# Altium project UWB-Anchor.PrjPCB
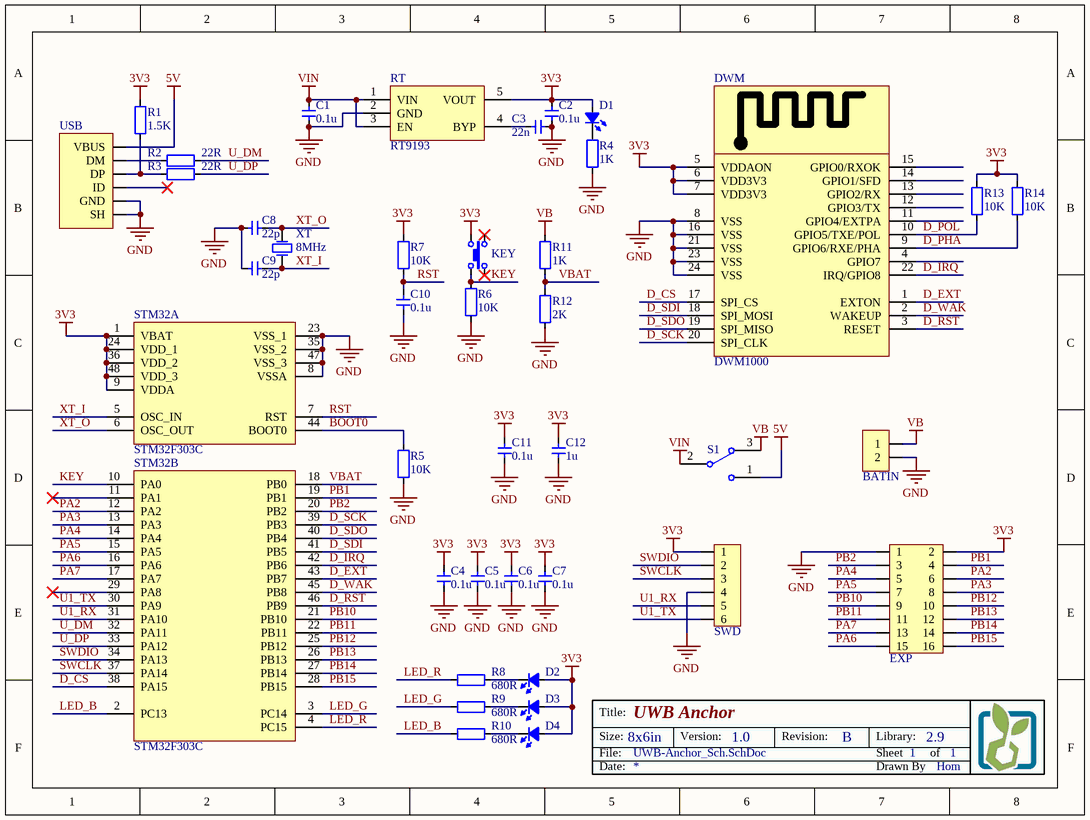
[diagram p0: UWB-Anchor_Sch.SchDoc]
1 sheet, 40 parts. Net scope: global (net labels, ports and power ports of the same name join across sheets).
Board file: UWB-Anchor_Pcb.PcbDoc

## Sheet UWB-Anchor_Sch.SchDoc: UWB Anchor
size 203 x 152 mm; Author: Hom; CompanyName: KitSprout; DrawnBy: Hom; Engineer: Hom; Organization: KitSprout; Revision: B; SheetNumber: 1; SheetTotal: 1; Version: 1.0; LibVersion: 2.9; PageSetup: Record=PageOptions|CenterHorizontal=True|CenterVertical=True|PrintScale=1.00|XCorrection=1.00|YCorrection=1.00|PrintKind=0|BorderSize=5000000|LeftOffset=0|BottomOffset=0|Orientation=2|PaperLength=1000|PaperWidth=1000|Scale=100|PaperSource=7|PrintQuality=-3|MediaType=1|DitherType=10|PrintScaleMode=0|PaperKind=A4|PaperIndex=9

### Parts
BATIN  MX1.25_2P  [MX1.25_S90_2P]  (value not drawn)
C1  value 0.1u  [CAP_0603]  (hidden comment: Cap_0603)
C2  value 0.1u  [CAP_0603]  (hidden comment: Cap_0603)
C3  value 22n  [CAP_0603]  (hidden comment: Cap_0603)
C4  value 0.1u  [CAP_0603]  (hidden comment: Cap_0603)
C5  value 0.1u  [CAP_0603]  (hidden comment: Cap_0603)
C6  value 0.1u  [CAP_0603]  (hidden comment: Cap_0603)
C7  value 0.1u  [CAP_0603]  (hidden comment: Cap_0603)
C8  value 22p  [CAP_0603]  (hidden comment: Cap_0603)
C9  value 22p  [CAP_0603]  (hidden comment: Cap_0603)
C10  value 0.1u  [CAP_0603]  (hidden comment: Cap_0603)
C11  value 0.1u  [CAP_0603]  (hidden comment: Cap_0603)
C12  value 1u  [CAP_0603]  (hidden comment: Cap_0603)
D1  LED_0603  [LED_0603_YELLOW]  (value not drawn)
D2  LED_0603  [LED_0603_RED]  (value not drawn)
D3  LED_0603  [LED_0603_GREEN]  (value not drawn)
D4  LED_0603  [LED_0603_BLUE]  (value not drawn)
DWM  DWM1000  [DWM1000]
EXP  HDR2x8_2.54  [HDR2X8_2.54_180]  (value not drawn)
KEY  ButtonTACT  [ButtonTACT_3.5*3.55_90]  (value not drawn)
R1  value 1.5K  [RES_0603]  (hidden comment: Res_0603)
R2  value 22R  [RES_0603]  (hidden comment: Res_0603)
R3  value 22R  [RES_0603]  (hidden comment: Res_0603)
R4  value 1K  [RES_0603]  (hidden comment: Res_0603)
R5  value 10K  [RES_0603]  (hidden comment: Res_0603)
R6  value 10K  [RES_0603]  (hidden comment: Res_0603)
R7  value 10K  [RES_0603]  (hidden comment: Res_0603)
R8  value 680R  [RES_0603]  (hidden comment: Res_0603)
R9  value 680R  [RES_0603]  (hidden comment: Res_0603)
R10  value 680R  [RES_0603]  (hidden comment: Res_0603)
R11  value 1K  [RES_0603]  (hidden comment: Res_0603)
R12  value 2K  [RES_0603]  (hidden comment: Res_0603)
R13  value 10K  [RES_0603]  (hidden comment: Res_0603)
R14  value 10K  [RES_0603]  (hidden comment: Res_0603)
RT  RT9193  [SOT23-5]
S1  SwitchSPDT_2.8x6.6_90  [SwitchSPDT_2.8X6.6_90]  (value not drawn)
STM32  STM32F303C  [LQFP_P0.5_48]  (parts A,B of 2)
SWD  HDR1x6_1.27  [HDR1X6_1.27_180HFD]  (value not drawn)
USB  USB_Micro  [USB_Micro-AB]  (value not drawn)
XT  value 8MHz  [XT_5032_2]  (hidden comment: XTAL_5032_2P)

### Nets
3V3: C2.2 C4.2 C5.2 C6.2 C7.2 C11.1 C12.1 D1.1(A) D2.1(A) D3.1(A) D4.1(A) DWM.5(VDDAON) DWM.6(VDD3V3) DWM.7(VDD3V3) EXP.2 KEY.2 R1.1 R7.2 R13.2 R14.2 RT.5(VOUT) STM32.1(VBAT) STM32.9(VDDA) STM32.24(VDD_1) STM32.36(VDD_2) STM32.48(VDD_3) SWD.1
5V: S1.1 USB.1(VBUS)
GND: BATIN.2 C1.1 C2.1 C3.1 C4.1 C5.1 C6.1 C7.1 C8.2 C9.2 C10.1 C11.2 C12.2 DWM.8(VSS) DWM.16(VSS) DWM.21(VSS) DWM.23(VSS) DWM.24(VSS) EXP.1 R4.1 R5.1 R6.1 R12.2 RT.2(GND) STM32.8(VSSA) STM32.23(VSS_1) STM32.35(VSS_2) STM32.47(VSS_3) SWD.4 USB.0(SH) USB.5(GND)
VB: BATIN.1 R11.1 S1.3
VIN: C1.2 RT.1(VIN) RT.3(EN) S1.2
BOOT0: R5.2 STM32.44(BOOT0)
D_CS: DWM.17(SPI_CS) STM32.38(PA15)
D_EXT: DWM.1(EXTON) STM32.43(PB7)
D_IRQ: DWM.22(IRQ/GPIO8) STM32.42(PB6)
D_PHA: DWM.9(GPIO6/RXE/PHA) R14.1
D_POL: DWM.10(GPIO5/TXE/POL) R13.1
D_RST: DWM.3(RESET) STM32.46(PB9)
D_SCK: DWM.20(SPI_CLK) STM32.39(PB3)
D_SDI: DWM.18(SPI_MOSI) STM32.41(PB5)
D_SDO: DWM.19(SPI_MISO) STM32.40(PB4)
D_WAK: DWM.2(WAKEUP) STM32.45(PB8)
KEY: KEY.1 R6.2 STM32.10(PA0)
LED_B: R10.2 STM32.2(PC13)
LED_G: R9.2 STM32.3(PC14)
LED_R: R8.2 STM32.4(PC15)
PA2: EXP.6 STM32.12(PA2)
PA3: EXP.8 STM32.13(PA3)
PA4: EXP.5 STM32.14(PA4)
PA5: EXP.7 STM32.15(PA5)
PA6: EXP.15 STM32.16(PA6)
PA7: EXP.13 STM32.17(PA7)
PB1: EXP.4 STM32.19(PB1)
PB2: EXP.3 STM32.20(PB2)
PB10: EXP.9 STM32.21(PB10)
PB11: EXP.11 STM32.22(PB11)
PB12: EXP.10 STM32.25(PB12)
PB13: EXP.12 STM32.26(PB13)
PB14: EXP.14 STM32.27(PB14)
PB15: EXP.16 STM32.28(PB15)
RST: C10.2 R7.1 STM32.7(RST)
SWCLK: STM32.37(PA14) SWD.3
SWDIO: STM32.34(PA13) SWD.2
U1_RX: STM32.31(PA10) SWD.5
U1_TX: STM32.30(PA9) SWD.6
U_DM: R2.2 STM32.32(PA11)
U_DP: R3.2 STM32.33(PA12)
VBAT: R11.2 R12.1 STM32.18(PB0)
XT_I: C9.1 STM32.5(OSC_IN) XT.1(OSC1)
XT_O: C8.1 STM32.6(OSC_OUT) XT.2(OSC2)
NetC3_2: C3.2 RT.4(BYP)
NetD1_2: D1.2(K) R4.2
NetD2_2: D2.2(K) R8.1
NetD3_2: D3.2(K) R9.1
NetD4_2: D4.2(K) R10.1
NetR1_2: R1.2 R3.1 USB.3(DP)
NetR2_1: R2.1 USB.2(DM)

Not connected (* = marked no-connect by the designer): DWM 4(GPIO7) 11(GPIO4/EXTPA) 12(GPIO3/TX) 13(GPIO2/RX) 14(GPIO1/SFD) 15(GPIO0/RXOK); KEY 3* 4*; STM32 11(PA1)* 29(PA8)*; USB 4(ID)*

### Notes on the sheet
- Title:
- Size:
- Date:
- File:
- 8x6in
- Version:
- Revision:
- Sheet
- Drawn By
- Library:
- of

### Library data of the parts
BATIN = MX1.25_2P: MX
C1-C12 = Cap_0603: Capacitor
D1-D4 = LED_0603: LED
DWM = DWM1000: Module; Manufacturer: Decawave Limited; Frequency: 3.5GHz ~ 6.5GHz; Data Rate: 6.8Mbps; Serial Interfaces: SPI; Antenna Type: Integrated, Chip; Voltage - Supply: 2.8 V ~ 3.6 V; Current - Receiving: 64mA; Current - Transmitting: 31mA; Supplier 1: Digi-Key; Manufacturer Part Number: DWM1000; RoHS: RoHS Compliant; Category: RF/IF and RFID; Stock 1: 1028; Pricing 1: 1=32.16, 10=26.704, 100=24.24, 250=22.51296 (USD); Packaging: Cut Tape (CT); RF Family/Standard: 802.15.4; Protocol: -; Modulation: -; Power - Output: -; Sensitivity: -; Memory Size: -; Mounting Type: Surface Mount; Operating Temperature: -40°C ~ 85°C; Package / Case: Module; ComponentLink1URL: http://www.decawave.com/sites/default/files/product-pdf/dwm1000-product-brief.pdf; ComponentLink1Description: http://www.decawave.com/sites/default/files/product-pdf/dwm1000-product-brief.pdf; Supplier Part Number 1: 1479-1002-1-ND
EXP = HDR2x8_2.54: Header
KEY = ButtonTACT: Button
R1-R14 = Res_0603: Resistor
RT = RT9193: Power
S1 = SwitchSPDT_2.8x6.6_90: Switch
STM32 = STM32F103C: MCU
SWD = HDR1x6_1.27: Header
USB = USB_Micro: USB
XT = XTAL_5032_2P: Crystal Oscillator